# EAGLE design stepper-driver v1 (EAGLE 7.6.0)
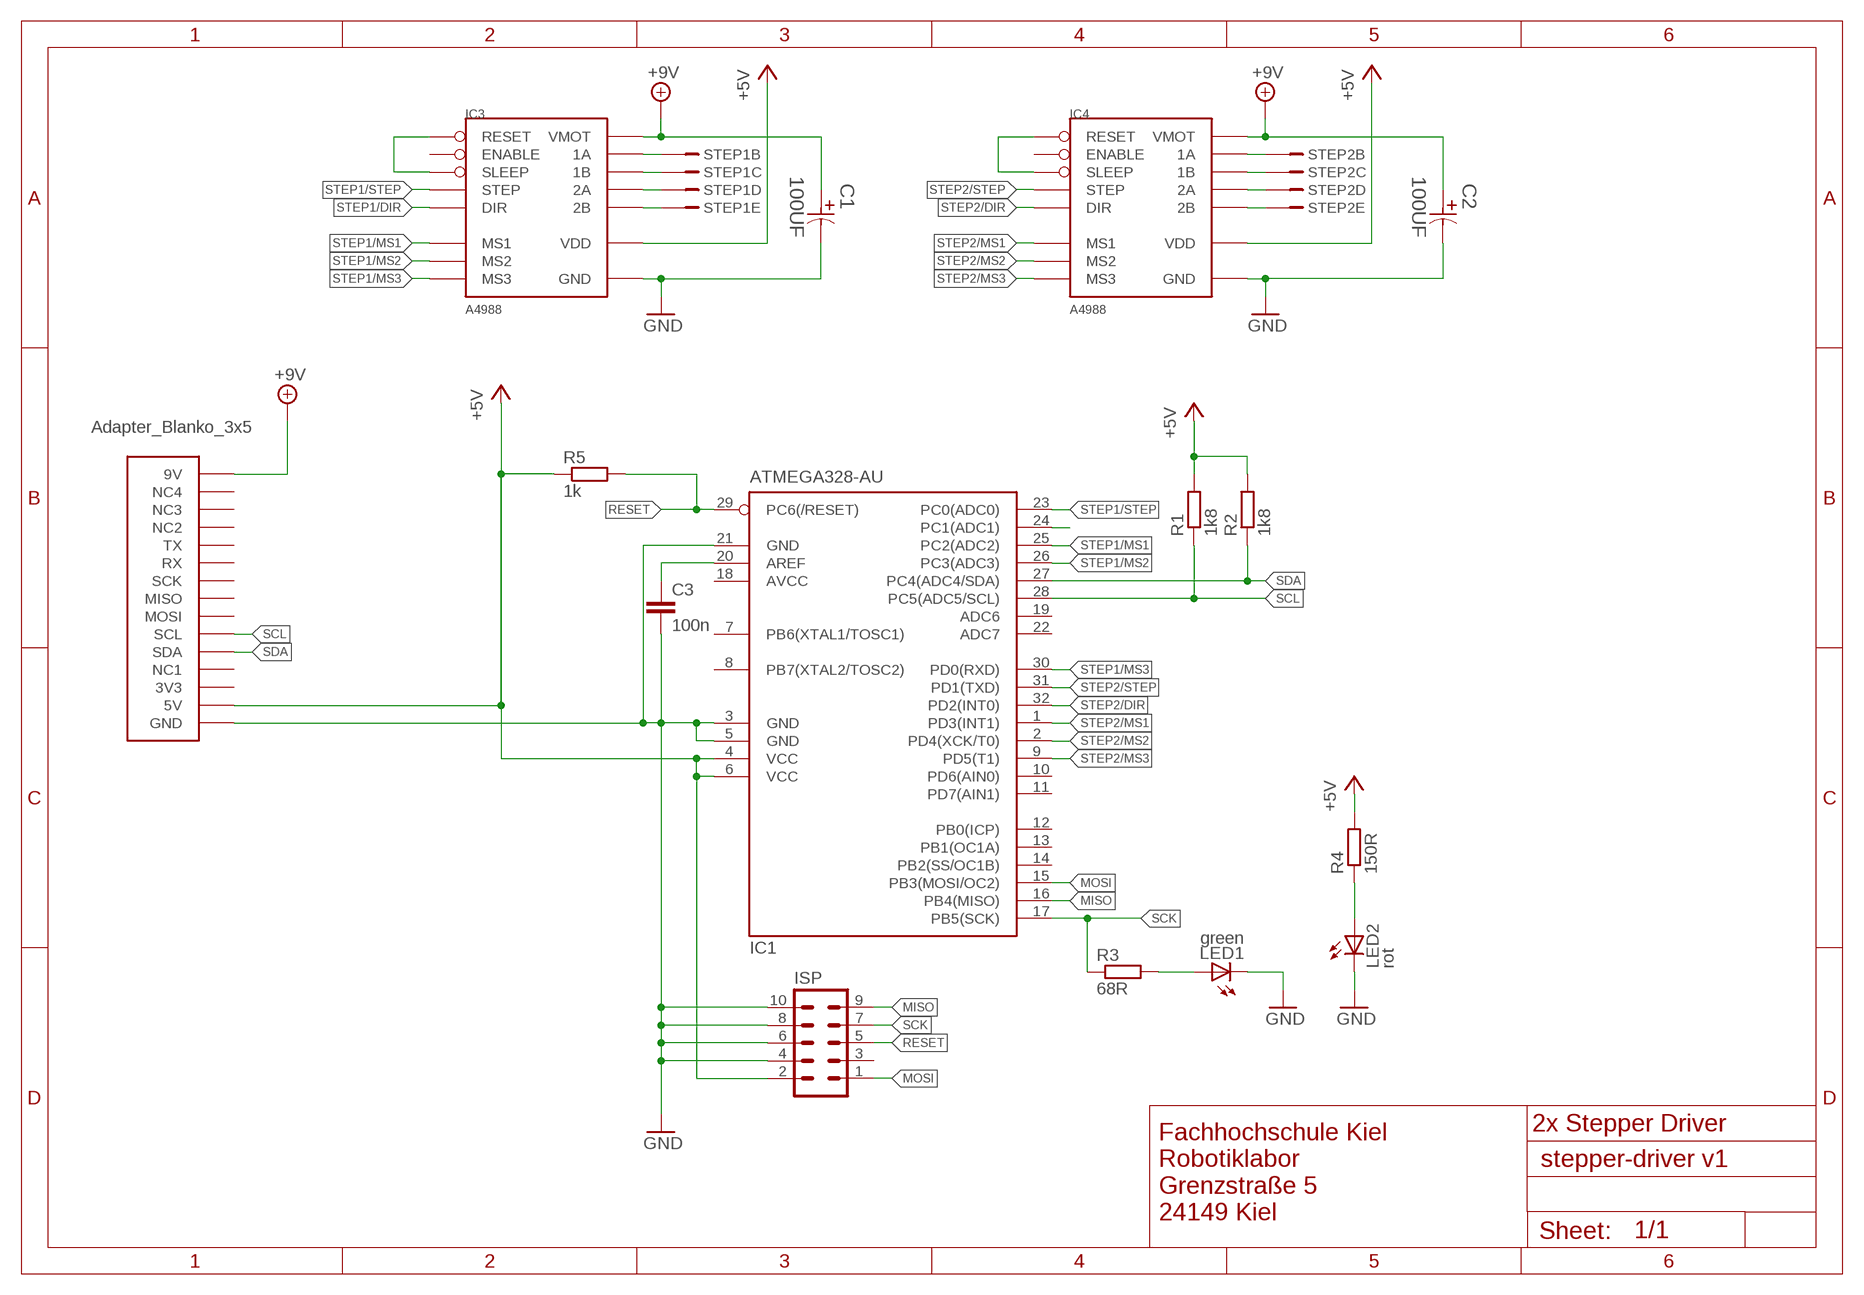
[diagram p0: schematic, sheet 1]

## Parts
ADAPTER  ADAPTER_BLANKO_3X5B2  [ADAPTER_BLANKO_3X5_B2]
C1  100UF  EEE-FK0J101AP-CASE-D  [CAPAE660X610N]
C2  100UF  EEE-FK0J101AP-CASE-D  [CAPAE660X610N]
C3  100n  C-EUC0805K  [C0805K]
IC1  ATMEGA328-AU  MEGA8-AI  [TQFP32-08]
IC3  A4988  [A4988SHIELD-SMD]
IC4  A4988  [A4988SHIELD-SMD]
ISP  ML10L  [ML10L]
LED1  green  LEDCHIP-LED0805  [CHIP-LED0805]
LED2  rot  LEDCHIP-LED0805  [CHIP-LED0805]
R1  1k8  R-EU_R0805W  [R0805W]
R2  1k8  R-EU_R0805W  [R0805W]
R3  68R  R-EU_R0805W  [R0805W]
R4  150R  R-EU_R0805W  [R0805W]
R5  1k  R-EU_R0805W  [R0805W]
STEP1  B5B-XH-A  [B5B-XH-A]
STEP2  B5B-XH-A  [B5B-XH-A]

## Nets
+5V: ADAPTER.5V ADAPTER.5V_1(5V) IC1.4(VCC) IC1.6(VCC) IC3.VDD IC4.VDD ISP.2 R1.2 R2.2 R4.2 R5.1
+9V: ADAPTER.9V ADAPTER.9V_1(9V) C1.1 C2.1 IC3.VMOT IC4.VMOT
GND: ADAPTER.GND ADAPTER.GND1(GND) ADAPTER.GND2(GND) ADAPTER.GND3(GND) C1.2 C2.2 C3.2 IC1.3(GND) IC1.5(GND) IC1.21(GND) IC3.GND IC3.GND1(GND) IC4.GND IC4.GND1(GND) ISP.4 ISP.6 ISP.8 ISP.10 LED1.C LED2.C
MISO: IC1.16(PB4(MISO)) ISP.9
MOSI: IC1.15(PB3(MOSI/OC2)) ISP.1
N$2: C3.1 IC1.20(AREF)
N$6: LED1.A R3.2
N$7: LED2.A R4.1
N$11: IC3.2B STEP1.5
N$12: IC3.2A STEP1.4
N$13: IC3.1B STEP1.3
N$14: IC3.1A STEP1.2
N$15: IC4.1A STEP2.2
N$16: IC4.1B STEP2.3
N$17: IC4.2A STEP2.4
N$18: IC4.2B STEP2.5
RESET: IC1.29(PC6(/RESET)) ISP.5 R5.2
SCK: IC1.17(PB5(SCK)) ISP.7 R3.1
SCL: ADAPTER.SCL ADAPTER.SCL_1(SCL) IC1.28(PC5(ADC5/SCL)) R1.1
SDA: ADAPTER.SDA ADAPTER.SDA_1(SDA) IC1.27(PC4(ADC4/SDA)) R2.1
STEP1/DIR: IC1.24(PC1(ADC1)) IC3.DIR
STEP1/MS1: IC1.25(PC2(ADC2)) IC3.MS1
STEP1/MS2: IC1.26(PC3(ADC3)) IC3.MS2
STEP1/MS3: IC1.30(PD0(RXD)) IC3.MS3
STEP1/RESET: IC3.RESET IC3.SLEEP
STEP1/STEP: IC1.23(PC0(ADC0)) IC3.STEP
STEP2/DIR: IC1.32(PD2(INT0)) IC4.DIR
STEP2/MS1: IC1.1(PD3(INT1)) IC4.MS1
STEP2/MS2: IC1.2(PD4(XCK/T0)) IC4.MS2
STEP2/MS3: IC1.9(PD5(T1)) IC4.MS3
STEP2/RESET: IC4.RESET IC4.SLEEP
STEP2/STEP: IC1.31(PD1(TXD)) IC4.STEP
Unconnected: ADAPTER.3V3 ADAPTER.3V3_1(3V3) ADAPTER.MISO ADAPTER.MISO_1(MISO) ADAPTER.MOSI ADAPTER.MOSI_1(MOSI) ADAPTER.NC1 ADAPTER.NC2 ADAPTER.NC3 ADAPTER.NC4 ADAPTER.NC5(NC1) ADAPTER.NC6(NC2) ADAPTER.NC7(NC3) ADAPTER.NC8(NC4) ADAPTER.RX ADAPTER.RX_1(RX) ADAPTER.SCK ADAPTER.SCK_1(SCK) ADAPTER.TX ADAPTER.TX_1(TX) IC1.7(PB6(XTAL1/TOSC1)) IC1.8(PB7(XTAL2/TOSC2)) IC1.10(PD6(AIN0)) IC1.11(PD7(AIN1)) IC1.12(PB0(ICP)) IC1.13(PB1(OC1A)) IC1.14(PB2(SS/OC1B)) IC1.19(ADC6) IC1.22(ADC7) IC3.ENABLE IC4.ENABLE ISP.3 STEP1.1 STEP2.1

## Notes on the sheet
- 2x Stepper Driver
- Fachhochschule Kiel
  Robotiklabor
  Grenzstraße 5
  24149 Kiel

## Power pins joined to a net without a drawn wire
AVCC: IC1.18(AVCC)

## Library data of the parts
ADAPTER = Tim:ADAPTER_BLANKO_3X5: B1 = Beschriftung innen B2 = Beschriftung aussen
C1 C2 = Panasonic-EEEFK_EEEFP:EEE-: Aluminum Electrolytic Capacitors,Surface Mount Type; MPN: EEE-FK0J101AP; OC_FARNELL: 1244389; OC_NEWARK: 13M4887; PACKAGE: CASE-D; SUPPLIER: PANASONIC; TOLERANCE: ±20 %; VOLTAGERATING: 6.3V
C3 = rcl:C-EU: CAPACITOR, European symbol
IC1 = atmel:MEGA8: MICROCONTROLLER 8 Kbytes FLASH, 1 kbytes SRAM, 512 bytes EEPROM, USART, 6-channel 10 bit ADC, 2-channel 8 bit ADC Pin compatible with Atmega48, ATMega88, ATMega168 Source: avr.lbr; MPN: ATMEGA8-16AU; OC_FARNELL: 9171371; OC_NEWARK: 73M8863
IC3 IC4 = allegro:A4988: A4988 DMOS Microstepping Driver with Translator and Overcurrent Protection
ISP = con-ml:ML10L: HARTING; OC_FARNELL: unknown; OC_NEWARK: unknown
LED1 LED2 = led:LED: LED OSRAM: - CHIPLED LG R971, LG N971, LY N971, LG Q971, LY Q971, LO R971, LY R971 LH N974, LH R974 LS Q976, LO Q976, LY Q976 LO Q996 - Hyper CHIPLED LW Q18S LB Q993, LB Q99A, LB R99A - SideLED LS A670, LO A670, LY A670, LG A670, LP A670 LB A673, LV A673, LT A673, LW A673 LH A674 LY A675 LS A676, LA A676, LO A676, LY A676, LW A676 LS A679, LY A679, LG A679 - Hyper Micro SIDELED® LS Y876, LA Y876, LO Y876, LY Y876 LT Y87S - SmartLED LW L88C, LW L88S LB L89C, LB L89S, LG L890 LS L89K, LO L89K, LY L89K LS L896, LA L896, LO L896, LY L896 - TOPLED LS T670, LO T670, LY T670, LG T670, LP T670 LSG T670, LSP T670, LSY T670, LOP T670, LYG T670 LG T671, LOG T671, LSG T671 LB T673, LV T673, LT T673, LW T673 LH T674 LS T676, LA T676, LO T676, LY T676, LB T676, LH T676, LSB T676, LW T676 LB T67C, LV T67C, LT T67C, LS T67K, LO T67K, LY T67K, LW E67C LS E67B, LA E67B, LO E67B, LY E67B, LB E67C, LV E67C, LT E67C LW T67C LS T679, LY T679, LG T679 LS T770, LO T770, LY T770, LG T770, LP T770 LB T773, LV T773, LT T773, LW T773 LH T774 LS E675, LA E675, LY E675, LS T675 LS T776, LA T776, LO T776, LY T776, LB T776 LHGB T686 LT T68C, LB T68C - Hyper Mini TOPLED® LB M676 - Mini TOPLED Santana® LG M470 LS M47K, LO M47K, LY M47K Source: http://www.osram.convergy.de LUXEON: - LUMILED® LXK2-PW12-R00, LXK2-PW12-S00, LXK2-PW14-U00, LXK2-PW14-V00 LXK2-PM12-R00, LXK2-PM12-S00, LXK2-PM14-U00 LXK2-PE12-Q00, LXK2-PE12-R00, LXK2-PE12-S00, LXK2-PE14-T00, LXK2-PE14-U00 LXK2-PB12-K00, LXK2-PB12-L00, LXK2-PB12-M00, LXK2-PB14-N00, LXK2-PB14-P00, LXK2-PB14-Q00 LXK2-PR12-L00, LXK2-PR12-M00, LXK2-PR14-Q00, LXK2-PR14-R00 LXK2-PD12-Q00, LXK2-PD12-R00, LXK2-PD12-S00 LXK2-PH12-R00, LXK2-PH12-S00 LXK2-PL12-P00, LXK2-PL12-Q00, LXK2-PL12-R00 Source: www.luxeon.com KINGBRIGHT: KA-3528ASYC Source: www.kingbright.com
R1-R5 = rcl:R-EU_: RESISTOR, European symbol
STEP1 STEP2 = con-jst:B5B: XH connector series 5 pins B5B-XH-A connector

## Board
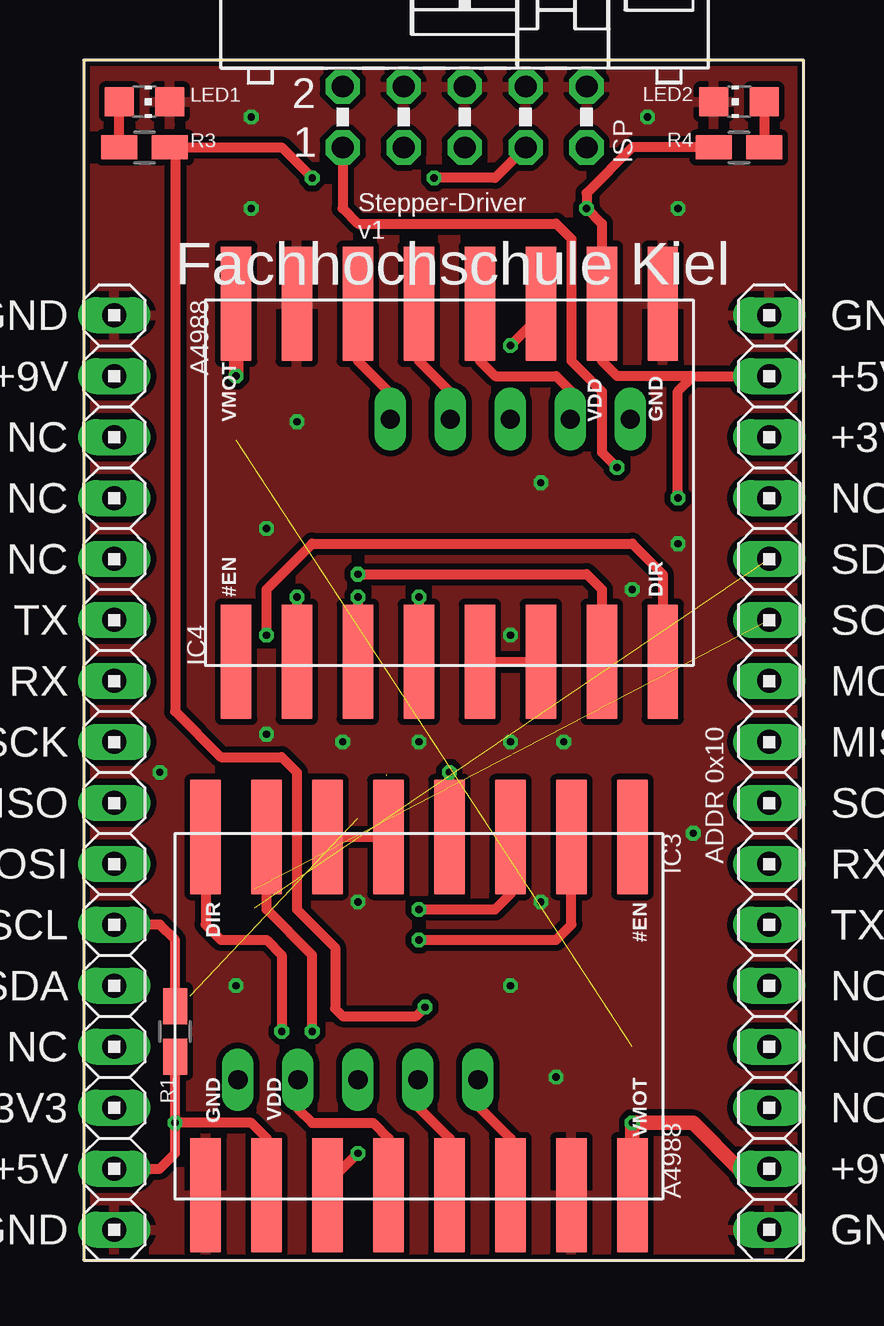
[diagram p1: board, top side]
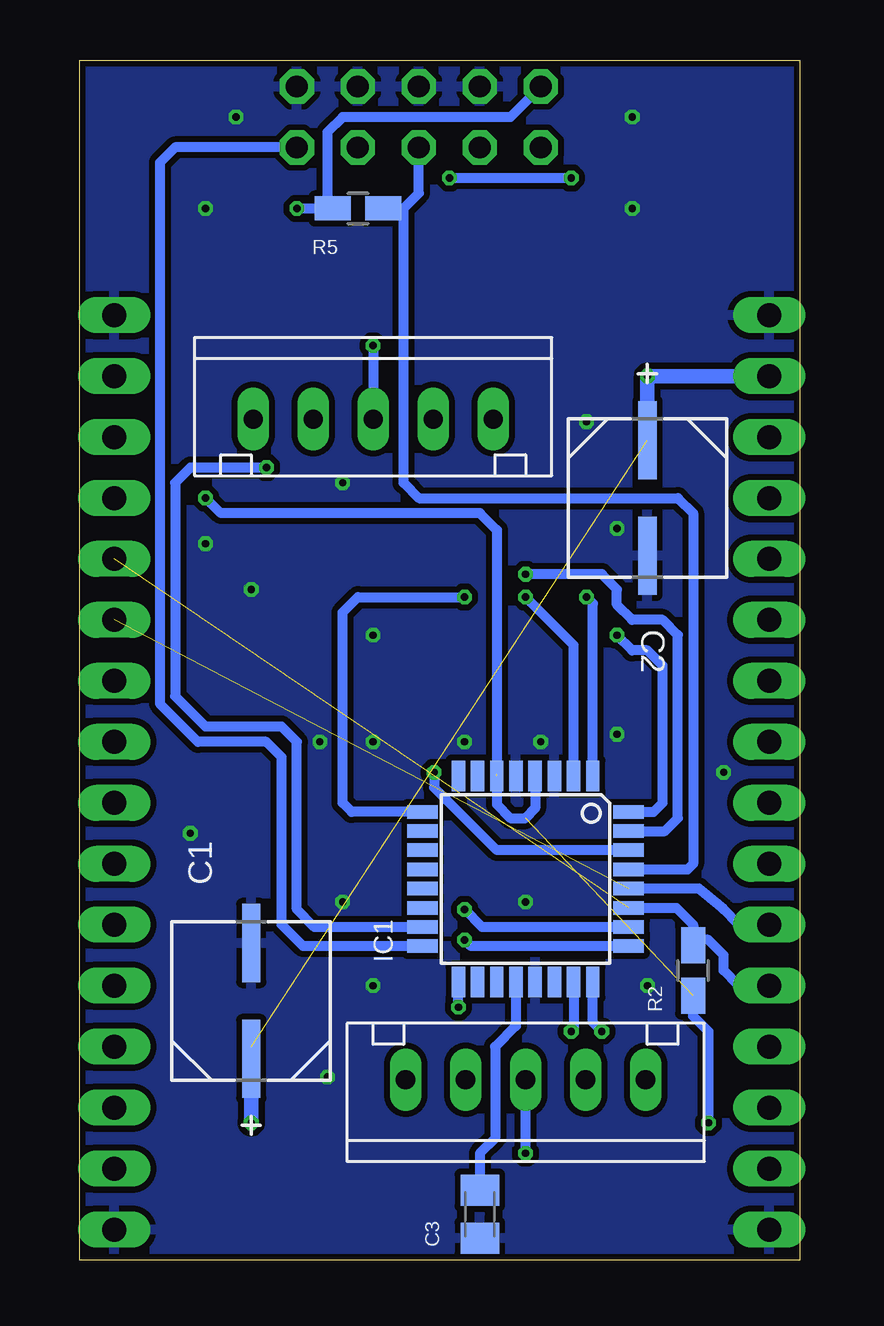
[diagram p2: board, bottom side, seen from below]

Size 30 x 50 mm. Coordinates in mm from the lower left corner, seen from the top.
Outline: 0,0 30,0 30,50 0,50 0,0
Copper layers (1*16): Top 0.035mm / dielectric 1.5mm / Bottom 0.035mm
Design rules "dirt_cheap_dirty_boards.v1": minimum track width 5mil, minimum drill 12mil, track to track 5mil, track to pad 5mil, pad to pad 5mil, via to via 5mil, smd to smd 0mil, copper to edge 10mil, drill to drill 10mil, minimum pad ring 10mil, minimum via ring 6mil, stop-mask expansion 2mil, vias tented up to drill 25mil, thermal gap 10mil

### Footprints (pad centres in the part's own frame; a part is rotated, then mirrored left to right if it is on the bottom)
ADAPTER_BLANKO_3X5_B2 = drill 1 long: 3V3 1.278,6.349; 3V3_1 28.566,34.289; 5V 1.278,3.809; 5V_1 28.566,36.829; 9V 1.278,36.829; 9V_1 28.566,3.809; GND 1.278,1.269; GND1 1.278,39.369; GND2 28.566,39.369; GND3 28.566,1.269; MISO 1.278,19.049; MISO_1 28.566,21.589; MOSI 1.278,16.509; MOSI_1 28.566,24.129; NC1 1.278,8.889; NC2 1.278,29.209; NC3 1.278,31.749; NC4 1.278,34.289; NC5 28.566,31.749; NC6 28.566,11.429; NC7 28.566,8.889; NC8 28.566,6.349; RX 1.278,24.129; RX_1 28.566,16.509; SCK 1.278,21.589; SCK_1 28.566,19.049; SCL 1.278,13.969; SCL_1 28.566,26.669; SDA 1.278,11.429; SDA_1 28.566,29.209; TX 1.278,26.669; TX_1 28.566,13.969
CAPAE660X610N = smd 3.251 x 0.762: 1 -2.413,0; 2 2.413,0
C0805K = smd 1.3 x 1.6: 1 -1,0; 2 1,0
TQFP32-08 = smd 1.27 x 0.559: 1 -4.293,2.8; 2 -4.293,2; 3 -4.293,1.2; 4 -4.293,0.4; 5 -4.293,-0.4; 6 -4.293,-1.2; 7 -4.293,-2; 8 -4.293,-2.8; 17 4.293,-2.8; 18 4.293,-2; 19 4.293,-1.2; 20 4.293,-0.4; 21 4.293,0.4; 22 4.293,1.2; 23 4.293,2; 24 4.293,2.8 | smd 0.559 x 1.27: 9 -2.8,-4.293; 10 -2,-4.293; 11 -1.2,-4.293; 12 -0.4,-4.293; 13 0.4,-4.293; 14 1.2,-4.293; 15 2,-4.293; 16 2.8,-4.293; 25 2.8,4.293; 26 2,4.293; 27 1.2,4.293; 28 0.4,4.293; 29 -0.4,4.293; 30 -1.2,4.293; 31 -2,4.293; 32 -2.8,4.293
A4988SHIELD-SMD = smd 4.763 x 1.27: 1A 7.461,-1.27; 1B 7.461,-3.81; 2A 7.461,1.27; 2B 7.461,3.81; DIR -7.461,-8.89; ENABLE -7.461,8.89; GND 7.461,6.35; GND1 7.461,-8.89; MS1 -7.461,6.35; MS2 -7.461,3.81; MS3 -7.461,1.27; RESET -7.461,-1.27; SLEEP -7.461,-3.81; STEP -7.461,-6.35; VDD 7.461,-6.35; VMOT 7.461,8.89
ML10L = drill 0.914 octagon: 1 -5.08,-1.27; 2 -5.08,1.27; 3 -2.54,-1.27; 4 -2.54,1.27; 5 0,-1.27; 6 0,1.27; 7 2.54,-1.27; 8 2.54,1.27; 9 5.08,-1.27; 10 5.08,1.27
CHIP-LED0805 = smd 1.2 x 1.2: A 0,-1.05; C 0,1.05
R0805W = smd 1.5 x 1: 1 -1.052,0; 2 1.052,0
B5B-XH-A = drill 0.8 long: 1 -5,-0.525; 2 -2.5,-0.525; 3 0,-0.525; 4 2.5,-0.525; 5 5,-0.525

### Placement (x,y rotation side)
ADAPTER  0,0 0 top
C1  22.86,10.79 90 bottom
C2  6.35,31.75 270 bottom
C3  13.34,1.91 270 bottom
IC1  11.43,15.88 270 bottom
IC3  13.97,10.16 270 top
IC4  15.24,32.38 90 top
ISP  15.88,47.62 0 top
LED1  2.54,48.26 270 top
LED2  27.3,48.26 90 top
R1  3.81,9.53 270 top
R2  4.45,12.06 270 bottom
R3  2.54,46.35 180 top
R4  27.3,46.35 180 top
R5  18.41,43.81 0 bottom
STEP1  11.43,6.99 180 bottom
STEP2  17.78,35.56 0 bottom

### Tracks (layer width: path | path; a pad name or v marks a point on that pad's centre or on a via)
+5V  (via drill 0.3)  (2 unrouted)
  Top 0.406: 25.4,36.83 22.23,36.83 21.59,37.47 IC4.VDD 21.59,43.18 v20.95,43.81 20.95,44.45 22.86,46.35 R4.2 | IC3.VDD 7.62,5.08 6.99,5.71 v3.81,5.71 | v24.77,31.75 24.77,36.2 25.4,36.83 | v3.81,5.71 R1.2 | v3.81,5.71 3.81,4.45 3.17,3.81 ADAPTER.5V | 25.4,36.83 ADAPTER.5V_1
  Bottom 0.406: v20.95,43.81 R5.1 19.68,43.81 19.68,46.99 19.05,47.62 12.06,47.62 ISP.2 | v24.77,31.75 24.13,31.11 13.34,31.11 12.63,30.41 IC1.6 12.63,18.98 12.06,18.41 11.43,18.41 11.03,18.82 IC1.4 | 12.63,20.25 12.7,20.32 | R2.2 4.45,10.16 3.81,9.53 v3.81,5.71
+9V  (via drill 0.3)  (1 unrouted)
  Top 0.61: IC3.VMOT v22.86,5.71 25.4,5.71 27.3,3.81 ADAPTER.9V_1 | v6.35,36.83 IC4.VMOT
  Bottom 0.406: 22.86,8.89 C1.1 | 6.22,34.29 C2.1
  Bottom 0.61: C1.1 v22.86,5.71 | C2.1 v6.35,36.83 ADAPTER.9V
GND  (via drill 0.3)
  other vias: 19.68,7.62 6.35,11.43 25.4,17.78 17.78,21.59 19.05,32.38 24.77,43.81 8.89,34.92 22.86,27.94 11.43,14.92 19.05,14.92 7.62,30.48 24.77,29.84 6.99,47.62 23.5,47.62 17.78,11.43 20,21.59 6.99,43.81 7.62,21.91 10.79,21.59 13.97,21.59 17.78,26.04 3.17,20.32
  pour Bottom (isolate 0.254): 0,0 29.84,0 29.84,50.16 0,50.16
  pour Top (isolate 0.254): 0,0 29.84,0 29.84,50.16 0,50.16
MISO
  Bottom 0.406: ISP.9 26.04,46.35 26.67,45.72 26.67,23.18 25.08,21.59 22.23,21.59 21.59,20.95 21.59,13.97 20.7,13.07 IC1.16
MOSI  (via drill 0.3)
  Top 0.406: ISP.1 10.79,43.81 11.43,43.18 19.68,43.18 20.32,42.55 20.32,37.47 21.59,36.2 21.59,33.66 v22.23,33.02
  Bottom 0.406: IC1.15 20.23,13.88 20.95,14.61 20.95,21.59 21.59,22.23 24.77,22.23 26.04,23.5 26.04,32.38 25.4,33.02 v22.23,33.02
N$2
  Bottom 0.406: IC1.20 11.83,9.76 12.7,8.89 12.7,5.08 13.34,4.45 C3.1
N$6
  Top 0.406: R3.2 LED1.A
N$7
  Top 0.406: LED2.A R4.1
N$11
  Top 0.406: STEP1.5 16.43,6.43 17.78,5.08 IC3.2B
N$12
  Top 0.406: STEP1.4 13.93,6.39 15.24,5.08 IC3.2A
N$13  (via drill 0.3)
  Top 0.406: IC3.1B 10.16,3.17 v11.43,4.45
  Bottom 0.406: v11.43,4.45 STEP1.3
N$14
  Top 0.406: STEP1.2 8.93,6.31 9.53,5.71 12.06,5.71 12.7,5.08 IC3.1A
N$15
  Top 0.406: IC4.1A 16.51,37.47 17.14,36.83 19.68,36.83 20.32,36.2 20.32,35.08 STEP2.2
N$16  (via drill 0.3)
  Top 0.406: IC4.1B 19.05,39.37 v17.78,38.1
  Bottom 0.406: v17.78,38.1 STEP2.3
N$17
  Top 0.406: IC4.2A 13.97,37.47 15.24,36.2 15.24,35.08 STEP2.4
N$18
  Top 0.406: IC4.2B 11.43,37.47 12.7,36.2 12.7,35.12 STEP2.5
RESET
  Bottom 0.406: R5.2 16.51,43.81 | 16.51,43.81 15.88,44.45 ISP.5 | IC1.29 4.68,16.27 4.45,16.51 4.45,31.11 5.08,31.75 15.88,31.75 16.51,32.38 16.51,43.81
SCK  (via drill 0.3)
  Top 0.406: ISP.7 17.14,45.09 v14.61,45.09 | v9.53,45.09 8.26,46.35 R3.1 3.81,46.14 3.81,22.86 5.71,20.95 8.26,20.95 8.89,20.32 8.89,14.61 10.48,13.02 10.48,10.48 10.79,10.16 13.86,10.16 v14.23,10.54
  Bottom 0.406: v14.61,45.09 v9.53,45.09 | 14.29,11.43 14.23,11.37 IC1.17 v14.23,10.54
SCL  (1 unrouted)
  Top 0.406: R1.1 3.81,13.34 3.17,13.97 ADAPTER.SCL
  Bottom 0.406: IC1.28 4.21,15.47 3.17,14.61 2.54,13.97 ADAPTER.SCL
SDA  (1 unrouted)
  Bottom 0.406: IC1.27 5.15,14.68 4.45,13.97 R2.1 4.23,13.34 3.81,13.34 3.17,12.7 3.17,12.06 2.54,11.43 ADAPTER.SDA
STEP1/DIR  (via drill 0.3)
  Top 0.406: IC3.DIR 5.08,13.97 5.71,13.34 7.62,13.34 8.26,12.7 v8.26,9.53
  Bottom 0.406: v8.26,9.53 8.63,9.9 IC1.24
STEP1/MS1  (via drill 0.3)
  Top 0.406: v13.97,13.34 19.68,13.34 20.32,13.97 IC3.MS1
  Bottom 0.406: IC1.25 13.71,13.07 v13.97,13.34
STEP1/MS2  (via drill 0.3)
  Top 0.406: v13.97,14.61 17.14,14.61 17.78,15.24 IC3.MS2
  Bottom 0.406: IC1.26 13.24,13.88 v13.97,14.61
STEP1/MS3  (via drill 0.3)
  Top 0.406: v15.24,20.32 IC3.MS3
  Bottom 0.406: v15.24,20.32 15.24,19.68 14.61,19.05 12.63,17.07 IC1.30
STEP1/RESET
  Top 0.406: IC3.RESET IC3.SLEEP
STEP1/STEP  (via drill 0.3)
  Top 0.406: v9.53,9.53 9.53,12.7 7.62,14.61 IC3.STEP
  Bottom 0.406: IC1.23 9.43,9.62 v9.53,9.53
STEP2/DIR  (via drill 0.3)
  Top 0.406: v7.62,26.04 7.62,27.94 9.53,29.84 22.86,29.84 24.13,28.57 IC4.DIR
  Bottom 0.406: IC1.32 6.09,18.68 5.71,19.05 5.71,24.77 6.35,25.4 6.99,25.4 v7.62,26.04
STEP2/MS1  (via drill 0.3)
  Top 0.406: v8.89,27.62 IC4.MS1
  Bottom 0.406: IC1.1 8.63,27.36 v8.89,27.62
STEP2/MS2  (via drill 0.3)
  Top 0.406: v11.43,27.62 IC4.MS2
  Bottom 0.406: IC1.2 9.43,25.62 v11.43,27.62
STEP2/MS3  (via drill 0.3)
  Top 0.406: v13.97,27.62 IC4.MS3
  Bottom 0.406: IC1.9 18.68,18.68 19.05,19.05 19.05,26.99 18.41,27.62 v13.97,27.62
STEP2/RESET
  Top 0.406: IC4.RESET IC4.SLEEP
STEP2/STEP  (via drill 0.3)
  Top 0.406: v11.43,28.57 20.95,28.57 21.59,27.94 IC4.STEP
  Bottom 0.406: IC1.31 5.62,17.88 5.08,18.41 5.08,26.04 5.71,26.67 6.99,26.67 7.62,27.3 7.62,27.94 8.26,28.57 v11.43,28.57

### Text on the board
tNames: Stepper-Driver / v1 | Fachhochschule Kiel | ADDR 0x10